# Altium schematic sheet External_Trigger_Buffer.SchDoc
size A4; CompanyName: WEITI ISE; Address1: ul. Nowowiejska 15/19; Address2: 00-665 Warszawa; DocumentNumber: 4; SheetNumber: 4; SheetTotal: 11
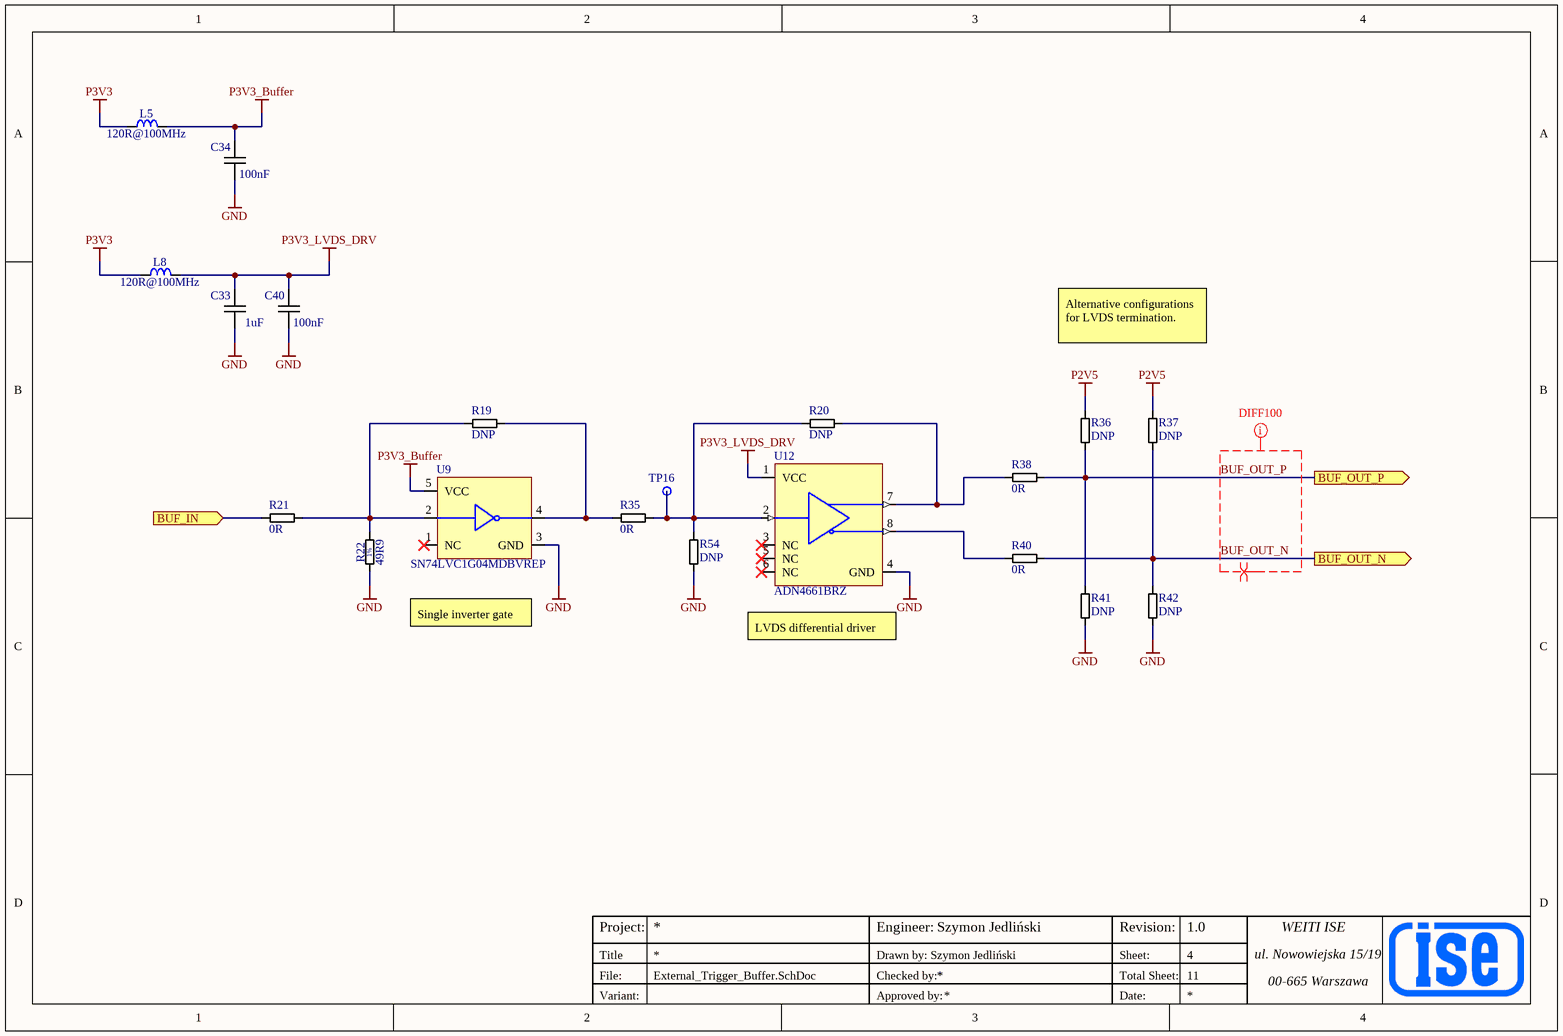
[diagram p0: External_Trigger_Buffer.SchDoc]

## Parts
C33  1uF  [CAPC0603X90N]
C34  100nF  [CAPC0603X90N]
C40  100nF  [CAPC0603X90N]
L5  120R@100MHz  [INDC0603X90N]
L8  120R@100MHz  [INDC0603X90N]
R19  DNP  [RESC0402X40N]
R20  DNP  [RESC0402X40N]
R21  0R  [RESC0402X40N]
R22  49R9  [RESC0402X40N]
R35  0R  [RESC0402X40N]
R36  DNP  [RESC0402X40N]
R37  DNP  [RESC0402X40N]
R38  0R  [RESC0402X40N]
R40  0R  [RESC0402X40N]
R41  DNP  [RESC0402X40N]
R42  DNP  [RESC0402X40N]
R54  DNP  [RESC0402X40N]
TP16  TestPoint  [TESTPOINT_SMD_C1P27MM]  (value not drawn)  (no BOM)
U9  SN74LVC1G04MDBVREP  [SOT23-5]
U12  ADN4661BRZ  [SOIC-8]

## Ports
BUF_IN (in), BUF_OUT_N (out), BUF_OUT_P (out)

## Nets
GND: C33.2 C34.2 C40.2 R22.1 R41.1 R42.1 R54.1 U9.3(GND) U12.4(GND)
P2V5: R36.2 R37.2
P3V3: L5.1 L8.1
P3V3_Buffer: C34.1 L5.2 U9.5(VCC)
P3V3_LVDS_DRV: C33.1 C40.1 L8.2 U12.1(VCC)
BUF_IN: R21.1 ; port BUF_IN
BUF_OUT_N: R37.1 R40.2 R42.2 ; port BUF_OUT_N
BUF_OUT_P: R36.1 R38.2 R41.2 ; port BUF_OUT_P
NetR19_1: R19.1 R35.1 U9.4(Y)
NetR19_2: R19.2 R21.2 R22.2 U9.2(A)
NetR20_1: R20.1 R38.1 U12.7(DOUT+)
NetR20_2: R20.2 R35.2 R54.2 TP16.1 U12.2(DIN)
NetR40_1: R40.1 U12.8(DOUT-)

Not connected (* = marked no-connect by the designer): U9 1(NC)*; U12 3(NC)* 5(NC)* 6(NC)*

## Layout directives
mark named DIFF100: BUF_OUT_N, BUF_OUT_P
differential pair; differential pair class DIFF100_LINES; net class DIFF100: BUF_OUT_N, BUF_OUT_P

## Notes on the sheet
- Alternative configurations for LVDS termination.
- Single inverter gate
- (near U12) LVDS differential driver
- Project:
- Title
- File:
- Drawn by:
- Engineer:
- Checked by:
- Szymon Jedliński
- Sheet:
- Revision:
- Total Sheet:
- 1.0
- Variant:
- Approved by:
- Date:

## Library data of the parts
C33 = CC0603_1UF_16V_10%_X7R: Non-polarised capacitor; Manufacturer Part Number: CL10B105KO8NNNC; DesignItemId: CC0603_1UF_16V_10%_X7R; HelpURL: https://www.mouser.pl/datasheet/2/585/MLCC-1837944.pdf; Height: 0.8mm; SMD: Yes; Value: 1uF
C34 C40 = CC0603_100NF_16V_10%_X7R: Non-polarised capacitor; Manufacturer Part Number: VJ0603Y104KXJCW1BC; DesignItemId: CC0603_100NF_16V_10%_X7R; HelpURL: https://www.vishay.com/docs/28548/vjw1bcbascomseries.pdf; Height: 0.8mm; SMD: Yes; Value: 100nF
L5 L8 = FB0603_120R@100MHZ_2A: Ferrite Bead; Manufacturer Part Number: BLM18PG121SN1D; Manufacturer 1 Component Height: 0.8mm; Tolerance: 25%; DesignItemId: FB0603_120R@100MHZ_2A; HelpURL: https://www.tme.eu/Document/19a35c43258593752611d1c31a7dbf1a/MURATA-BLM18P.pdf; SMD: Yes; Value: 120R@100MHz
R19 R20 R36 R37 R41 R42 R54 = R0402_DNP: General Purpose Thick Film Chip Resistor; Manufacturer 1 Component Height: 0.4mm; Voltage: 50V; DesignItemId: R0402_DNP; HelpURL: https://www.vishay.com/docs/20035/dcrcwe3.pdf; SMD: Yes; Value: DNP
R21 R35 R38 R40 = R0402_0R_JUMPER: General Purpose Thick Film Chip Resistor; Manufacturer Part Number: CRCW04020000Z0EDC; Manufacturer 1 Component Height: 0.4mm; Tolerance: 20mOhm; Voltage: 50V; DesignItemId: R0402_0R_JUMPER; HelpURL: https://www.vishay.com/docs/20035/dcrcwe3.pdf; SMD: Yes; Value: 0R
R22 = R0402_49R9_0.0625W_100PPM: General Purpose Thick Film Chip Resistor; Manufacturer Part Number: RC0402FR-0749R9L; Manufacturer 1 Component Height: 0.4mm; Tolerance: 1%; Voltage: 50V; DesignItemId: R0402_49R9_0.0625W_100PPM; HelpURL: https://www.mouser.pl/datasheet/2/447/PYu_RC_Group_51_RoHS_L_11-1984063.pdf; SMD: Yes; Value: 49R9
TP16 = TESTPOINT_SMD_C1P27MM: 1.27mm diameter SMD Test Point Area; DesignItemId: TESTPOINT_SMD_C1P27MM; Family: TestPoint; Part Description: 1.27mm diameter SMD Test Point Area
U9 = SN74LVC1G04MDBVREP: SINGLE INVERTER GATE; Manufacturer 1 Component Height: 1.45mm; DesignItemId: SN74LVC1G04MDBVREP; Device: SN74LVC1G04MDBVREP; HelpURL: https://www.ti.com/lit/ds/symlink/txs0108e.pdf?ts=1625042999829&ref_url=https%253A%252F%252Fwww.google.com%252F; Manufacturer 1 Example: SN74LVC1G04MDBVREP; Manufacturer 1 Part Number: SN74LVC1G04MDBVREP; SMD: Yes
U12 = ADN4661BRZ: ADN4661BRZ, Single, 3 V, CMOS, LVDS, High Speed Differential Driver; Manufacturer 1 Component Height: 1.75mm; DesignItemId: ADN4661BRZ; Device: ADN4661BRZ; HelpURL: https://www.analog.com/media/en/technical-documentation/data-sheets/ADN4661.pdf; Manufacturer Part Number: ADN4661BRZ; SMD: Yes